# Altium schematic sheet debugger.SchDoc
size 420 x 297 mm; Address1: Address1; Address2: Address2; Address3: Address3; Address4: Address4; DocumentNumber: АБВГ.123456.001 Э3; SheetNumber: 1; Scale: 1:1; DocumentType: Схема электрическая принципиальная; FirstReferrence: АБВГ.123456.001
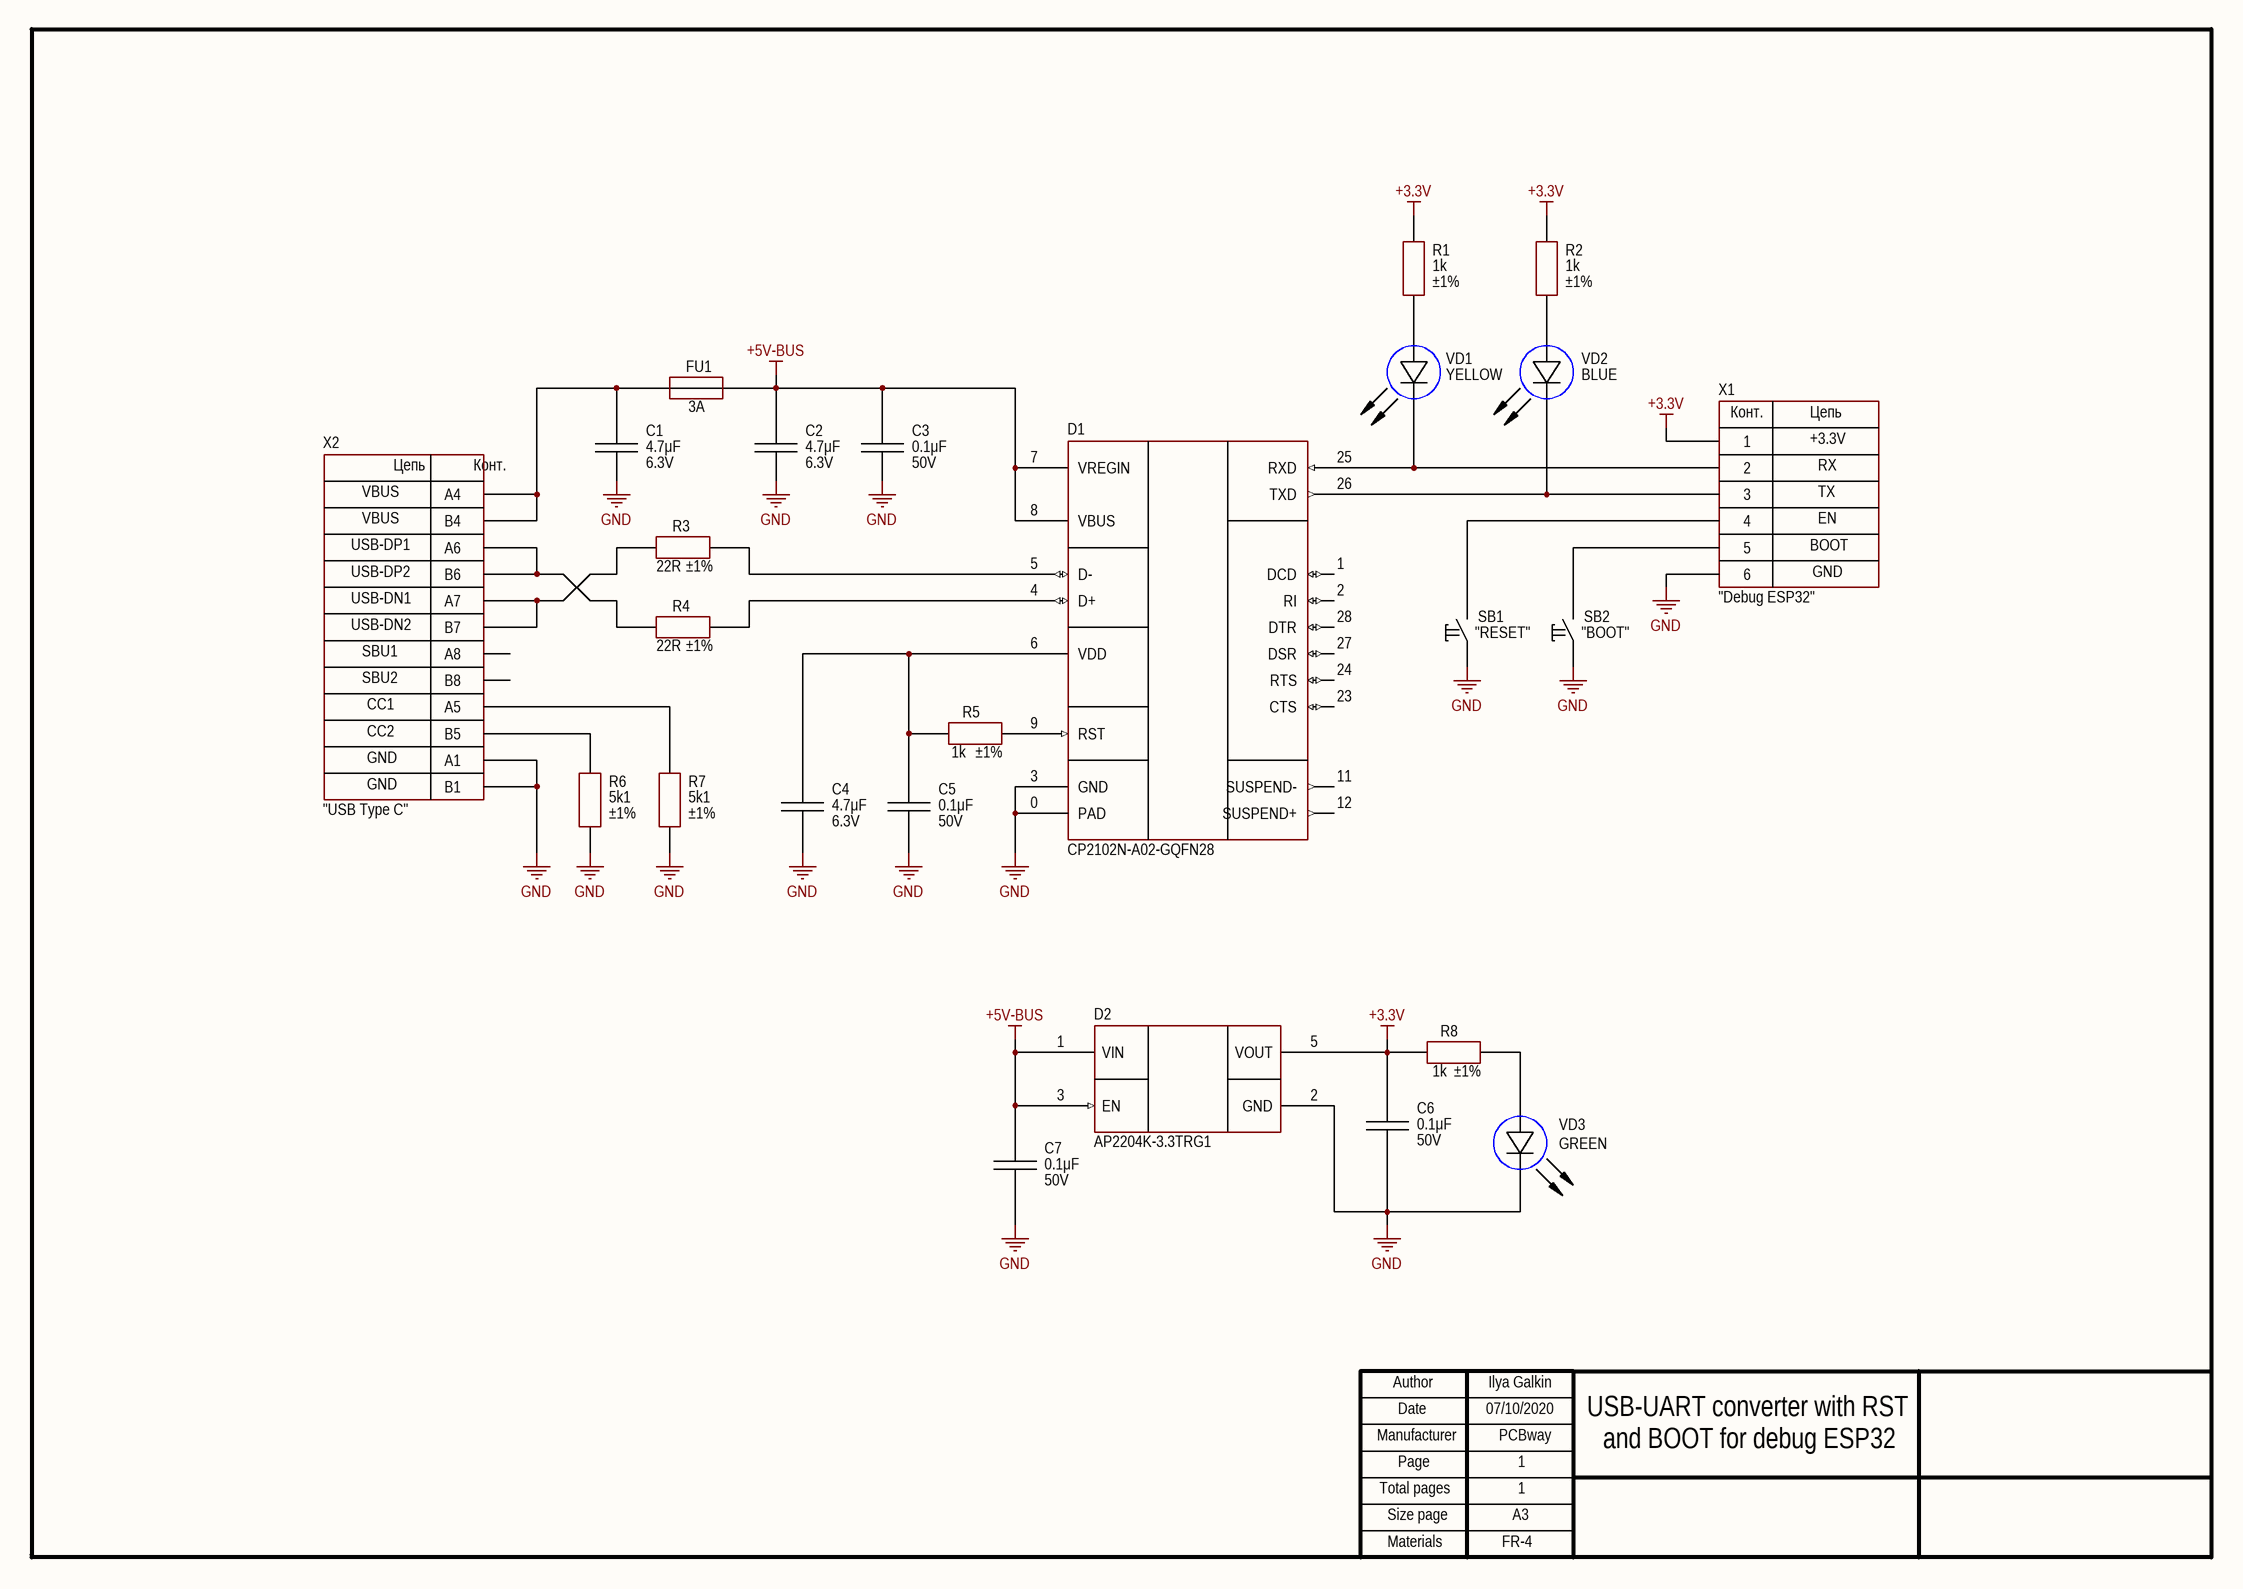
[diagram p0: debugger.SchDoc]

## Parts
C1  value 4.7μF  Voltage: 6.3V  [CAP: 0603]
C2  value 4.7μF  Voltage: 6.3V  [CAP: 0603]
C3  value 0.1μF  Voltage: 50V  [CAP: 0603]
C4  value 4.7μF  Voltage: 6.3V  [CAP: 0603]
C5  value 0.1μF  Voltage: 50V  [CAP: 0603]
C6  value 0.1μF  Voltage: 50V  [CAP: 0603]
C7  value 0.1μF  Voltage: 50V  [CAP: 0603]
D1  PartNumber: CP2102N-A02-GQFN28  [28-QFN (5x5)]
D2  (no value)  [SOT23-5]
FU1  MaxCurrent: 3A  [FUSE: 1206]
R1  value 1k  Tolerance: ±1%  [RES: 0603]
R2  value 1k  Tolerance: ±1%  [RES: 0603]
R3  value 22R  Tolerance: ±1%  [RES: 0603]
R4  value 22R  Tolerance: ±1%  [RES: 0603]
R5  value 1k  Tolerance: ±1%  [RES: 0603]
R6  value 5k1  Tolerance: ±1%  [RES: 0603]
R7  value 5k1  Tolerance: ±1%  [RES: 0603]
R8  value 1k  Tolerance: ±1%  [RES: 0603]
SB1  CommentText: "RESET"  [BUT: 6x3.5 SMD]
SB2  CommentText: "BOOT"  [BUT: 6x3.5 SMD]
VD1  Color: YELLOW  [LED: 0603Y]
VD2  Color: BLUE  [LED: 0603B]
VD3  Color: GREEN  [LED: 0603G]
X1  CommentText: "Debug ESP32"  [CON: SM06B-GHS]
X2  CommentText: "USB Type C"  [CON: TYPE-C-31-M-12]

## Nets
+3.3V: C6.2 D2.5(VOUT) R1.2 R2.2 R8.2 X1.1
+5V-BUS: C2.2 C3.2 C7.2 D1.7(VREGIN) D1.8(VBUS) D2.1(VIN) D2.3(EN) FU1.2
GND: C1.1 C2.1 C3.1 C4.1 C5.1 C6.1 C7.1 D1.0(PAD) D1.3(GND) D2.2(GND) R6.1 R7.1 SB1.1 SB2.1 VD3.2(C) X1.6 X2.A1 X2.B1
NetC1_2: C1.2 FU1.1 X2.A4 X2.B4
NetC4_2: C4.2 C5.2 D1.6(VDD) R5.1
NetD1_4: D1.4(D+) R4.1
NetD1_5: D1.5(D-) R3.1
NetD1_9: D1.9(RST) R5.2
NetD1_25: D1.25(RXD) VD1.2(C) X1.2
NetD1_26: D1.26(TXD) VD2.2(C) X1.3
NetR1_1: R1.1 VD1.1(A)
NetR2_1: R2.1 VD2.1(A)
NetR3_2: R3.2 X2.A7 X2.B7
NetR4_2: R4.2 X2.A6 X2.B6
NetR6_2: R6.2 X2.B5
NetR7_2: R7.2 X2.A5
NetR8_1: R8.1 VD3.1(A)
NetSB1_2: SB1.2 X1.4
NetSB2_2: SB2.2 X1.5

Not connected (* = marked no-connect by the designer): D1 1(DCD) 2(RI) 11(SUSPEND-) 12(SUSPEND+) 23(CTS) 24(RTS) 27(DSR) 28(DTR); X2 A8 B8

## Notes on the sheet
- +3.3V
- RX
- TX
- EN
- BOOT
- GND
- Ilya Galkin
- 07/10/2020
- PCBway
- 1
- USB-UART converter with RST
- and BOOT for debug ESP32
- FR-4
- Author
- Manufacturer
- Date
- Page
- Total pages
- Size page
- A3
- Materials
- (in symbol Connector_SM06B) Конт.; Цепь
- (in symbol Connector_USB_Type_C) Цепь; Конт.; VBUS; USB-DP1; USB-DP2; USB-DN1; USB-DN2; SBU1; SBU2; CC1; CC2; GND

## Library data of the parts
C1 C2 C4 = Ceramic_0603: Manufacturer: Samsung; PartNumber: CL10B475KQ8NQNC; ValueManufacturerPartNumber: Ceramic capacitor, 4.7μF, X7R, ±10%, 6.3V, 0603, -55...+125°C; TypeCapacitor: Ceramic capacitor; Tolerance: ±10%; TypeDielectric: X7R; Package: 0603; HelpURL: https://www.digikey.com/product-detail/en/samsung-electro-mechanics/CL10B475KQ8NQNC/1276-2087-6-ND/3892601; Temperature: -55...+125°C
C3 C5-C7 = Ceramic_0603: Manufacturer: Samsung; PartNumber: CL10B104KB8NNNL; ValueManufacturerPartNumber: Ceramic capacitor, 0.1μF, X7R, ±10%, 50V, 0603, -55...+125°C; TypeCapacitor: Ceramic capacitor; Tolerance: ±10%; TypeDielectric: X7R; Package: 0603; HelpURL: https://www.digikey.com/product-detail/en/samsung-electro-mechanics/CL10B104KB8NNNL/1276-CL10B104KB8NNNLCT-ND/10320686; Temperature: -55...+125°C
D1 = CP2102N: USB-to-UART; Manufacturer: Silicon Labs; ValueManufacturerPartNumber: IC usb-to-uart bridge, USB2.0, 3...3.6V, -40...+85°C, 28-VFQFN; Supply: 3...3.6V; HelpURL: https://www.digikey.com/product-detail/en/silicon-labs/CP2102N-A02-GQFN28/336-5889-ND/9863477; Package: 28-VFQFN; ComponentType: IC usb-to-uart bridge; Temperature: -40...+85°C; Standard: USB2.0
D2 = AP2204K-3.3TRG1: Linear voltage regulator; Manufacturer: Diodes Incorporated; ValueManufacturerPartNumber: Linear voltage regulator, input 4...24V, 0.5V, output 3.3V, 0.15A, -40...+85°C, SOT23-6; VoltageInput: input 4...24V; MaxDropout: 0.5V; CurrentOutput: 0.15A; VoltageOutput: output 3.3V; HelpURL: https://www.digikey.com/product-detail/en/diodes-incorporated/AP2204K-3.3TRG1/AP2204K-3.3TRG1DICT-ND/4505288; Package: SOT23-6; ComponentType: Linear voltage regulator; Temperature: -40...+85°C; PartNumber: AP2204K-3.3TRG1
FU1 = Fuse: Manufacturer: Panasonic; PartNumber: ERB-RG3R00V; TypeFuse: Electromechanics relay; VoltageMax: 32VDC; Package: 1206 case; HelpURL: https://www.digikey.com/product-detail/en/panasonic-electronic-components/ERB-RG3R00V/P16741CT-ND/4280098; ValueManufacturerPartNumber: =TypeFuse+', '+VoltageMax+', '+MaxCurrent+', '+Package+', '+Temperature
R1 R2 R5 R8 = Resistor_0603: Manufacturer: Yageo; PartNumber: RC0603FR-071KL; ValueManufacturerPartNumber: Resistor film, 1k, ±1%, 0603, 0.1W, -55...+125°C; TypeResistor: Resistor film; Power: 0.1W; Package: 0603; HelpURL: https://www.digikey.com/product-detail/en/yageo/RC0603FR-071KL/311-1-00KHRCT-ND/729790; Temperature: -55...+125°C
R3 R4 = Resistor_0603: Manufacturer: Yageo; PartNumber: RC0603FR-0722RL; ValueManufacturerPartNumber: Resistor film, 22R, ±1%, 0603, 0.1W, -55...+125°C; TypeResistor: Resistor film; Power: 0.1W; Package: 0603; HelpURL: https://www.digikey.com/product-detail/en/yageo/RC0603FR-0722RL/311-22-0HRCT-ND/730002; Temperature: -55...+125°C
R6 R7 = Resistor_0603: Manufacturer: Yageo; PartNumber: RC0603FR-075K1L; ValueManufacturerPartNumber: Resistor film, 5k1, ±1%, 0603, 0.1W, -55...+125°C; TypeResistor: Resistor film; Power: 0.1W; Package: 0603; HelpURL: https://www.digikey.com/product-detail/en/yageo/RC0603FR-075K1L/311-5-10KHRCT-ND/730215; Temperature: -55...+125°C
SB1 = Button_tactile: Manufacturer: TE Connectivity; ValueManufacturerPartNumber: Tactile button, 6x6mm; PartNumber: FSM2JSMAATR; TypeButton: Tactile button; HelpURL: https://www.digikey.com/product-detail/en/te-connectivity-alcoswitch-switches/FSM2JSMAATR/450-1792-1-ND/3503931; Package: 6x6mm
SB2 = Button_tactile: Manufacturer: TE Connectivity; ValueManufacturerPartNumber: Tactile button, 6x3.5mm; PartNumber: FSM2JSMAATR; TypeButton: Tactile button; HelpURL: https://www.digikey.com/product-detail/en/te-connectivity-alcoswitch-switches/FSM2JSMAATR/450-1792-1-ND/3503931; Package: 6x3.5mm
VD1 = LED_single: Manufacturer: Wurth; ValueManufacturerPartNumber: LED, 20mA, 2V, 0603, -55...+150°C; PartNumber: 150060YS75000; TypeDiode: LED; Current: 20mA; VoltageDrop: 2V; Package: 0603; HelpURL: https://www.digikey.com/product-detail/en/wurth-electronics-inc/150060YS75000/732-4981-1-ND/4489907; Temperature: -55...+150°C
VD2 = LED_single: Manufacturer: Wurth; ValueManufacturerPartNumber: LED, 20mA, 3.2V, 0603, -55...+150°C; PartNumber: 150060BS75000; TypeDiode: LED; Current: 20mA; VoltageDrop: 3.2V; Package: 0603; HelpURL: https://www.digikey.com/product-detail/en/wurth-electronics-inc/150060BS75000/732-4966-1-ND/4489893; Temperature: -55...+150°C
VD3 = LED_single: Manufacturer: Wurth; ValueManufacturerPartNumber: LED, 20mA, 2V, 0603, -55...+150°C; PartNumber: 150060VS75000; TypeDiode: LED; Current: 20mA; VoltageDrop: 2V; Package: 0603; HelpURL: https://www.digikey.com/product-detail/en/w-rth-elektronik/150060VS75000/732-4980-1-ND/4489904; Temperature: -55...+150°C
X1 = Connector_SM06B: Manufacturer: JST; ValueManufacturerPartNumber: Connector, 6pin, 1.25mm, 50VDC, 1A; PartNumber: SM06B-GHS; VoltageMax: 50VDC; Pitch: 1.25mm; CurrentMax: 1A; Multichannel: 6pin; HelpURL: https://www.digikey.com/product-detail/en/jst-sales-america-inc/SM06B-GHS-TB-LF-SN/455-1568-1-ND/807836; TypeConnector: Connector
X2 = Connector_USB_Type_C: Manufacturer: Korean Hroparts; ValueManufacturerPartNumber: USB Type C, 3A; PartNumber: TYPE-C-31-M-12; TypeConnector: USB Type C; CurrentMax: 3A; HelpURL: https://lcsc.com/product-detail/USB-Type-C_Korean-Hroparts-Elec-TYPE-C-31-M-12_C165948.html